# Altium schematic sheet busanalizer.SchDoc: powersupply_grid8.sch
size 409 x 282 mm; Date: 12/19/2018 10:57:12 PM; SheetNumber: Sheet:
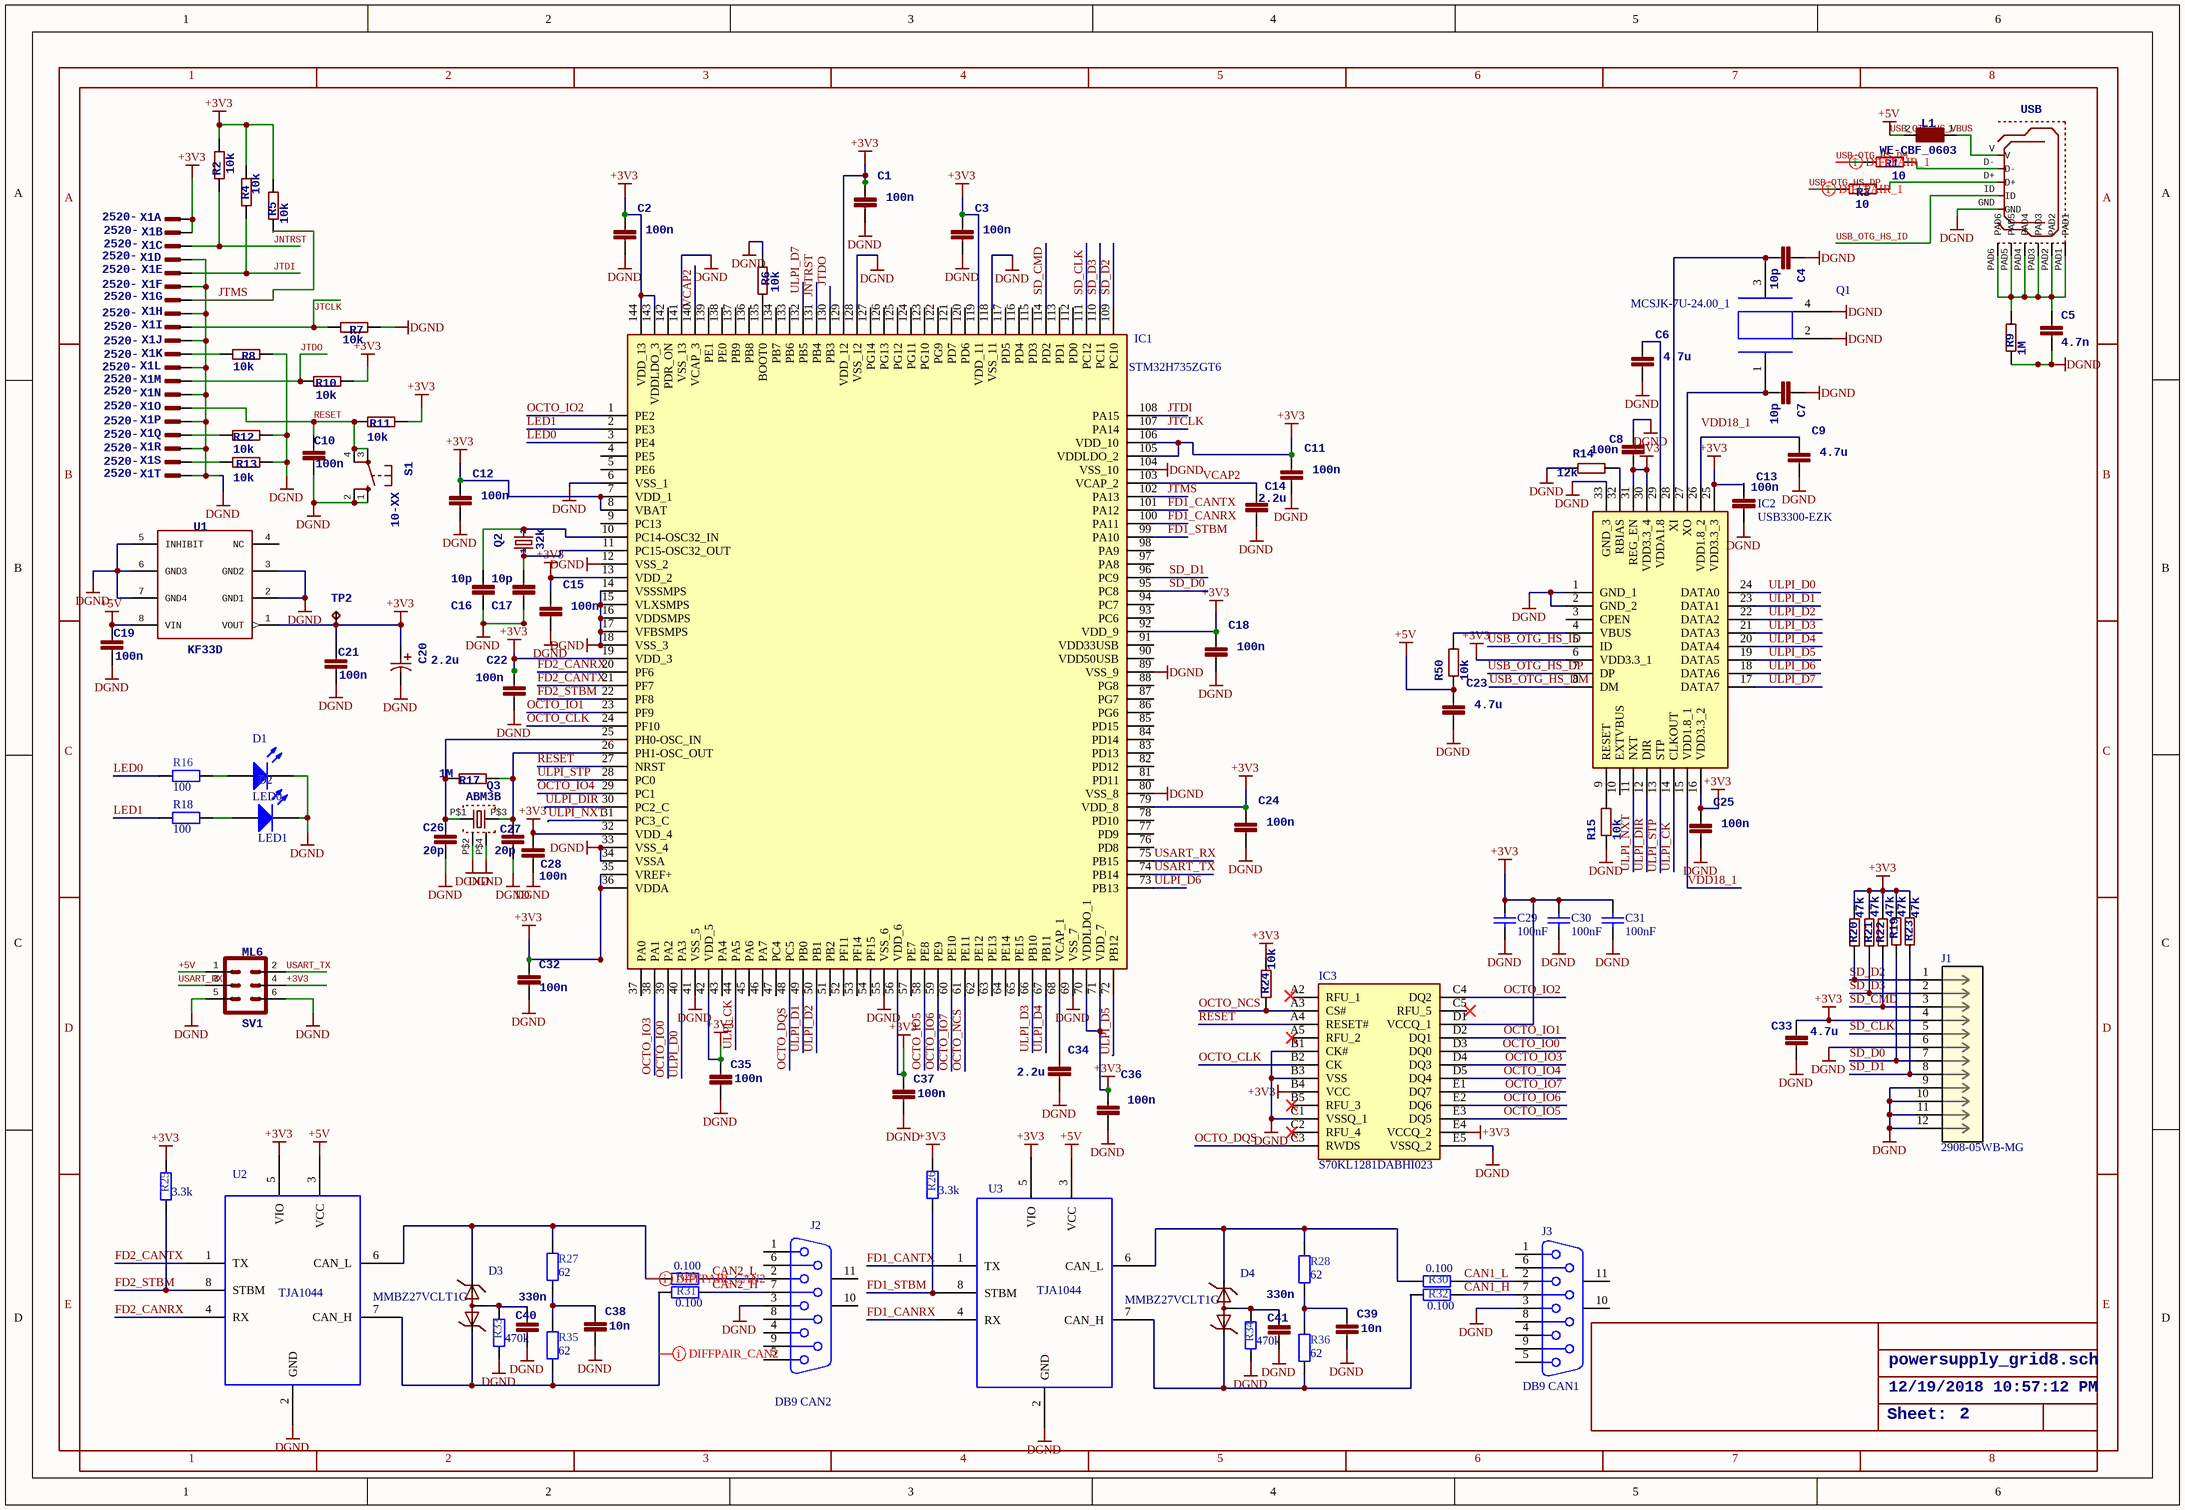
[diagram p0: busanalizer.SchDoc]

## Parts
C1  100n  [C0402]
C2  100n  [C0402]
C3  100n  [C0402]
C4  10p  [C0402]
C5  4.7n  [C0805]
C6  4.7u  [C0805]
C7  10p  [C0402]
C8  100n  [C0402]
C9  4.7u  [C0805]
C10  100n  [C0402]
C11  100n  [C0402]
C12  100n  [C0402]
C13  100n  [C0402]
C14  2.2u  [C0805]
C15  100n  [C0402]
C16  10p  [C0402]
C17  10p  [C0402]
C18  100n  [C0402]
C19  100n  [C0603]
C20  2.2u  [CAPAE430X610N]
C21  100n  [C0603]
C22  100n  [C0402]
C23  4.7u  [C0805]
C24  100n  [C0402]
C25  100n  [C0402]
C26  20p  [C0402]
C27  20p  [C0402]
C28  100n  [C0402]
C29  value 100nF  [C0402]  (hidden comment: Capacitor)
C30  value 100nF  [C0402]  (hidden comment: Capacitor)
C31  value 100nF  [C0402]  (hidden comment: Capacitor)
C32  100n  [C0402]
C33  4.7u  [C0805]
C34  2.2u  [C0805]
C35  100n  [C0402]
C36  100n  [C0402]
C37  100n  [C0402]
C38  10n  [C0805]
C39  10n  [C0805]
C40  330n  [C0805]
C41  330n  [C0805]
D1  LED0  [LED-0]
D2  LED1  [LED-0]
D3  MMBZ27VCLT1G  [SOT23]
D4  MMBZ27VCLT1G  [SOT23]
IC1  STM32H735ZGT6  [QFP50P2200X2200X160-144N]
IC2  USB3300-EZK  [QFN50P500X500X100-33N-D]
IC3  S70KL1281DABHI023  [BGA24C100P5X5_600X800X100]
J1  2908-05WB-MG  [CONN_3M_2900]
J2  DB9 CAN2  [DSUB1.385-2H9]
J3  DB9 CAN1  [DSUB1.385-2H9]
L1  WE-CBF_0603  [0603]
Q1  MCSJK-7U-24.00_1  [MCSJK-7U-24.00_1]
Q2  32k  [TC26V]
Q3  ABM3B  [ABM3B]
R1  10  [R0805]
R2  10k  [R0805]
R3  10  [R0805]
R4  10k  [R0805]
R5  10k  [R0805]
R6  10k  [R0805]
R7  10k  [R0805]
R8  10k  [R0805]
R9  1M  [R0805]
R10  10k  [R0805]
R11  10k  [R0805]
R12  10k  [R0805]
R13  10k  [R0805]
R14  12k  [R0805]
R15  10k  [R0805]
R16  value 100  [6-0805_L]  (hidden comment: Res2)
R17  1M  [R0402]
R18  value 100  [6-0805_L]  (hidden comment: Res2)
R19  47k  [R0805]
R20  47k  [R0805]
R21  47k  [R0805]
R22  47k  [R0805]
R23  47k  [R0805]
R24  10k  [R0805]
R25  value 3.3k  [R0805]  (hidden comment: Res2)
R26  value 3.3k  [R0805]  (hidden comment: Res2)
R27  value 62  [R0805]  (hidden comment: Res2)
R28  value 62  [R0805]  (hidden comment: Res2)
R29  value 0.100  [R0805]  (hidden comment: Res2)
R30  value 0.100  [R0805]  (hidden comment: Res2)
R31  value 0.100  [R0805]  (hidden comment: Res2)
R32  value 0.100  [R0805]  (hidden comment: Res2)
R33  value 470k  [R0805]  (hidden comment: Res2)
R34  value 470k  [R0805]  (hidden comment: Res2)
R35  value 62  [R0805]  (hidden comment: Res2)
R36  value 62  [R0805]  (hidden comment: Res2)
R50  10k  [R0805]
S1  10-XX  [B3F-10XX]
SV1  ML6  [ML6]
TP2  TPB2,54  [B2,54]  (value not drawn)
U1  KF33D  [SO8]
U2  TJA1044  [SO8]
U3  TJA1044  [SO8]
USB1  USB_MICROB  [USB_MICROB_PACKAGE]  (value not drawn)
X1  2520-  [PAK100/2500-20]  (parts A,B,C,D,E,F,G,H,I,J,K,L,M,N,O,P,Q,R,S,T of 20)

## Nets
+3V3: C1.1 C2.1 C3.1 C8.1 C11.1 C12.1 C13.1 C15.1 C18.1 C20.1 C21.1 C22.1 C24.1 C25.1 C28.1 C29.2 C30.2 C31.2 C32.1 C33.1 C35.1 C36.1 C37.1 IC1.7(VDD_1) IC1.8(VBAT) IC1.13(VDD_2) IC1.19(VDD_3) IC1.32(VDD_4) IC1.35(VREF+) IC1.36(VDDA) IC1.42(VDD_5) IC1.56(VDD_6) IC1.70(VDDLDO_1) IC1.71(VDD_7) IC1.79(VDD_8) IC1.92(VDD_9) IC1.105(VDDLDO_2) IC1.106(VDD_10) IC1.119(VDD_11) IC1.129(VDD_12) IC1.143(VDDLDO_3) IC1.144(VDD_13) IC2.6(VDD3.3_1) IC2.16(VDD3.3_2) IC2.25(VDD3.3_3) IC2.30(VDD3.3_4) IC2.31(REG_EN) IC3.B4(VCC) IC3.D1(VCCQ_1) IC3.E4(VCCQ_2) J1.4 R2.2 R4.2 R5.2 R10.1 R11.1 R19.2 R20.2 R21.2 R22.2 R23.2 R24.2 R25.2 R26.2 SV1.4 TP2.TP U1.1(VOUT) U2.5(VIO) U3.5(VIO) X1.1(KL) X1.2(KL)
+5V: C19.1 C23.1 L1.2 R50.1 SV1.1 U1.8(VIN) U2.3(VCC) U3.3(VCC)  [also labelled USB_OTG_HS_VBUS]
DGND: C1.2 C2.2 C3.2 C4.1 C5.2 C6.2 C7.1 C8.2 C9.2 C10.2 C11.2 C12.2 C13.2 C14.2 C15.2 C16.1 C17.1 C18.2 C19.2 C20.2 C21.2 C22.2 C23.2 C24.2 C25.2 C26.2 C27.2 C28.2 C29.1 C30.1 C31.1 C32.2 C33.2 C34.2 C35.2 C36.2 C37.2 C38.2 C39.2 C40.2 C41.2 D1.2(K) D2.2(K) IC1.6(VSS_1) IC1.12(VSS_2) IC1.14(VSSSMPS) IC1.15(VLXSMPS) IC1.16(VDDSMPS) IC1.17(VFBSMPS) IC1.18(VSS_3) IC1.33(VSS_4) IC1.34(VSSA) IC1.41(VSS_5) IC1.55(VSS_6) IC1.69(VSS_7) IC1.80(VSS_8) IC1.89(VSS_9) IC1.104(VSS_10) IC1.118(VSS_11) IC1.128(VSS_12) IC1.141(VSS_13) IC2.1(GND_1) IC2.2(GND_2) IC2.33(GND_3) IC3.B1(CK#) IC3.B3(VSS) IC3.C1(VSSQ_1) IC3.E5(VSSQ_2) J1.6 J1.9 J1.10 J1.11 J1.12 J2.3 J3.3 Q1.2 Q1.4 Q3.P$2 Q3.P$4 R6.1 R7.1 R8.1 R9.1 R12.1 R13.1 R14.1 R15.1 R33.1 R34.1 S1.1(S) S1.2(S1) SV1.5 SV1.6 U1.2(GND1) U1.3(GND2) U1.5(INHIBIT) U1.6(GND3) U1.7(GND4) U2.2(GND) U3.2(GND) USB1.GND X1.4(KL) X1.6(KL) X1.8(KL) X1.10(KL) X1.12(KL) X1.14(KL) X1.16(KL) X1.18(KL) X1.20(KL)
CAN1_H: J3.7 R32.2
CAN1_L: J3.2 R30.2
CAN2_H: J2.7 R31.2
CAN2_L: J2.2 R29.2
FD1_CANRX: IC1.100(PA11) U3.4(RX)
FD1_CANTX: IC1.101(PA12) U3.1(TX)
FD1_STBM: IC1.99(PA10) R26.1 U3.8(STBM)
FD2_CANRX: IC1.20(PF6) U2.4(RX)
FD2_CANTX: IC1.21(PF7) U2.1(TX)
FD2_STBM: IC1.22(PF8) R25.1 U2.8(STBM)
JNTRST: IC1.131(PB4) R2.1 X1.3(KL)
JTCLK: IC1.107(PA14) R7.2 X1.9(KL)
JTDI: IC1.108(PA15) R4.1 X1.5(KL)
JTDO: IC1.130(PB3) R10.2 X1.13(KL)
JTMS: IC1.102(PA13) R5.1 X1.7(KL)
LED0: IC1.3(PE4) R16.1
LED1: IC1.2(PE3) R18.1
OCTO_CLK: IC1.24(PF10) IC3.B2(CK)
OCTO_DQS: IC1.48(PC5) IC3.C3(RWDS)
OCTO_IO0: IC1.39(PA2) IC3.D3(DQ0)
OCTO_IO1: IC1.23(PF9) IC3.D2(DQ1)
OCTO_IO2: IC1.1(PE2) IC3.C4(DQ2)
OCTO_IO3: IC1.38(PA1) IC3.D4(DQ3)
OCTO_IO4: IC1.29(PC1) IC3.D5(DQ4)
OCTO_IO5: IC1.58(PE8) IC3.E3(DQ5)
OCTO_IO6: IC1.59(PE9) IC3.E2(DQ6)
OCTO_IO7: IC1.60(PE10) IC3.E1(DQ7)
OCTO_NCS: IC1.61(PE11) IC3.A3(CS#) R24.1
RESET: C10.1 IC1.27(NRST) IC3.A4(RESET#) R11.2 S1.3(P) S1.4(P1) X1.15(KL)
SD_CLK: IC1.111(PC12) J1.5
SD_CMD: IC1.114(PD2) J1.3 R22.1
SD_D0: IC1.95(PC8) J1.7 R19.1
SD_D1: IC1.96(PC9) J1.8 R23.1
SD_D2: IC1.109(PC10) J1.1 R20.1
SD_D3: IC1.110(PC11) J1.2 R21.1
ULPI_CK: IC1.44(PA5) IC2.14(CLKOUT)
ULPI_D0: IC1.40(PA3) IC2.24(DATA0)
ULPI_D1: IC1.49(PB0) IC2.23(DATA1)
ULPI_D2: IC1.50(PB1) IC2.22(DATA2)
ULPI_D3: IC1.66(PB10) IC2.21(DATA3)
ULPI_D4: IC1.67(PB11) IC2.20(DATA4)
ULPI_D5: IC1.72(PB12) IC2.19(DATA5)
ULPI_D6: IC1.73(PB13) IC2.18(DATA6)
ULPI_D7: IC1.132(PB5) IC2.17(DATA7)
ULPI_DIR: IC1.30(PC2_C) IC2.12(DIR)
ULPI_NXT: IC1.31(PC3_C) IC2.11(NXT)
ULPI_STP: IC1.28(PC0) IC2.13(STP)
USART_RX: IC1.75(PB15) SV1.3
USART_TX: IC1.74(PB14) SV1.2
USB_OTG_HS_DM: IC2.8(DM) R1.2
USB_OTG_HS_DP: IC2.7(DP) R3.2
USB_OTG_HS_ID: IC2.5(ID) USB1.ID
VCAP2: C14.1 IC1.103(VCAP_2) IC1.140(VCAP_3)
VDD18_1: IC2.15(VDD1.8_1)
NetC4_2: C4.2 IC2.28(XI) Q1.3
NetC5_1: C5.1 R9.2 USB1.PAD1 USB1.PAD2 USB1.PAD3 USB1.PAD4 USB1.PAD5 USB1.PAD6
NetC6_1: C6.1 IC2.29(VDDA1.8)
NetC7_2: C7.2 IC2.27(XO) Q1.1
NetC9_1: C9.1 IC2.26(VDD1.8_2)
NetC16_2: C16.2 IC1.10(PC14-OSC32_IN) Q2.2
NetC17_2: C17.2 IC1.11(PC15-OSC32_OUT) Q2.1
NetC26_1: C26.1 IC1.25(PH0-OSC_IN) Q3.P$1 R17.2
NetC27_1: C27.1 IC1.26(PH1-OSC_OUT) Q3.P$3 R17.1
NetC34_1: C34.1 IC1.68(VCAP_1)
NetC38_1: C38.1 R27.1 R35.2
NetC39_1: C39.1 R28.1 R36.2
NetC40_1: C40.1 D3.3(A) R33.2
NetC41_1: C41.1 D4.3(A) R34.2
NetD1_1: D1.1(A) R16.2
NetD2_1: D2.1(A) R18.2
NetD3_1: D3.1(K1) R27.2 R29.1 U2.6(CAN_L)
NetD3_2: D3.2(K2) R31.1 R35.1 U2.7(CAN_H)
NetD4_1: D4.1(K1) R28.2 R30.1 U3.6(CAN_L)
NetD4_2: D4.2(K2) R32.1 R36.1 U3.7(CAN_H)
NetIC1_135: IC1.135(BOOT0) R6.2
NetIC2_4: IC2.4(VBUS) R50.2
NetIC2_9: IC2.9(RESET) R15.2
NetIC2_32: IC2.32(RBIAS) R14.2
NetL1_1: L1.1 USB1.V
NetR1_1: R1.1 USB1.D-
NetR3_1: R3.1 USB1.D+
NetR8_2: R8.2 X1.11(KL)
NetR12_2: R12.2 X1.17(KL)
NetR13_2: R13.2 X1.19(KL)

Not connected (* = marked no-connect by the designer): IC1 4(PE5) 5(PE6) 9(PC13) 37(PA0) 43(PA4) 45(PA6) 46(PA7) 47(PC4) 51(PB2) 52(PF11) 53(PF14) 54(PF15) 57(PE7) 62(PE12) 63(PE13) 64(PE14) 65(PE15) 76(PD8) 77(PD9) 78(PD10) 81(PD11) 82(PD12) 83(PD13) 84(PD14) 85(PD15) 86(PG6) 87(PG7) 88(PG8) 90(VDD50USB) 91(VDD33USB) 93(PC6) 94(PC7) 97(PA8) 98(PA9) 112(PD0) 113(PD1) 115(PD3) 116(PD4) 117(PD5) 120(PD6) 121(PD7) 122(PG9) 123(PG10) 124(PG11) 125(PG12) 126(PG13) 127(PG14) 133(PB6) 134(PB7) 136(PB8) 137(PB9) 138(PE0) 139(PE1) 142(PDR_ON); IC2 3(CPEN) 10(EXTVBUS); IC3 A2(RFU_1) A5(RFU_2)* B5(RFU_3)* C2(RFU_4)* C5(RFU_5); J2 1 4 5 6 8 9 10(MH1) 11(MH2); J3 1 4 5 6 8 9 10(MH1) 11(MH2); U1 4(NC)

## Layout directives
differential pair: NetD3_1, NetD3_2, USB_OTG_HS_DM, USB_OTG_HS_DP

## Notes on the sheet
- Labels drawn without touching a wire or pin: VDD18_1
- 1
- 2
- 3
- 4
- 5
- 6
- 7
- 8
- A
- B
- C
- D
- E

## Library data of the parts
C1-C4 C6-C18 C22-C28 C32-C41 = C-EUC0402: <B>CAPACITOR</B>, European symbol; SPICEPREFIX: C
C5 = C-EUC0805: <B>CAPACITOR</B>, European symbol; SPICEPREFIX: C
C19 C21 = C-EUC0603: <B>CAPACITOR</B>, European symbol; SPICEPREFIX: C
C20 = EEE--CASE-B: MPN: EEE-FT0J101AR; MPN: EEE-FT1A680AR; MPN: EEE-FT1C470AR; MPN: EEE-FT1E220AR; MPN: EEE-FT1E330AR; MPN: EEE-FT1V220AR; MPN: EEE-FTH100UAR; MPN: EEE-HA0J220R; MPN: EEE-HA0J330WR; MPN: EEE-HA0J470WR; MPN: EEE-HA1A220WR; MPN: EEE-HA1A330WR; MPN: EEE-HA1C100R; MPN: EEE-HA1C220WR; MPN: EEE-HA1E100WR; MPN: EEE-HA1E4R7R; MPN: EEE-HA1H1R0R; MPN: EEE-HA1H2R2R; MPN: EEE-HA1H3R3R; MPN: EEE-HA1HR10R; MPN: EEE-HA1HR22R; MPN: EEE-HA1HR33R; MPN: EEE-HA1HR47R; MPN: EEE-HA1V100WR; MPN: EEE-HA1V4R7R; MPN: EEE-HB0J220R; MPN: EEE-HB1C100R; MPN: EEE-HB1E4R7R; MPN: EEE-HB1H1R0R; MPN: EEE-HB1H2R2R; MPN: EEE-HC0J220R; MPN: EEE-HC1C100R; MPN: EEE-HC1H1R0R; MPN: EEE-HC1H2R2R; MPN: EEE-HC1H3R3R; MPN: EEE-HC1HR10R; MPN: EEE-HC1HR33R; MPN: EEE-HC1HR47R; TOLERANCE: ±20 %; VOLTAGERATING: 6.3V; VOLTAGERATING: 10V; VOLTAGERATING: 16V; VOLTAGERATING: 25V; VOLTAGERATING: 35V; VOLTAGERATING: 50V; OC_FARNELL: 2065951; OC_NEWARK: 73T9146; PACKAGE: CASE-B; SUPPLIER: PANASONIC; OC_FARNELL: 2065959; OC_NEWARK: 73T9155; OC_FARNELL: 2065967; OC_NEWARK: 73T9160; OC_FARNELL: 1868402; OC_NEWARK: 31T8175; OC_FARNELL: 1868403; OC_NEWARK: 53W8320; OC_FARNELL: 1868413; OC_NEWARK: 31T8187; OC_FARNELL: 1868422; OC_NEWARK: 31T8171; OC_FARNELL: 1973274; OC_NEWARK: 58T9198; OC_FARNELL: 1973275; OC_NEWARK: 58T9199; OC_FARNELL: 1973276; OC_NEWARK: 58T9204; OC_FARNELL: 1973288; OC_NEWARK: 58T9209; OC_FARNELL: 1973291; OC_NEWARK: 58T9213; OC_FARNELL: 1973301; OC_NEWARK: 58T9217; OC_FARNELL: 1973302; OC_NEWARK: 58T9220; OC_FARNELL: 1973318; OC_NEWARK: 58T9233; OC_FARNELL: 1973317; OC_NEWARK: 58T9245; OC_FARNELL: 1973358; OC_NEWARK: 58T9253; OC_FARNELL: 1973359; OC_NEWARK: 58T9257; OC_FARNELL: 1973360; OC_NEWARK: 58T9260; OC_FARNELL: 1973353; OC_NEWARK: 58T9249; OC_FARNELL: 1973354; OC_NEWARK: 58T9250; OC_FARNELL: 1973355; OC_NEWARK: 58T9251; OC_FARNELL: 1973357; OC_NEWARK: unknown; OC_FARNELL: 1973338; OC_NEWARK: 58T9275; OC_FARNELL: 1973337; OC_NEWARK: 58T9286; OC_FARNELL: 9696750; OC_NEWARK: 96K9411; OC_FARNELL: 9696792; OC_NEWARK: 96K9414; OC_FARNELL: 9696822; OC_NEWARK: 96K9418; OC_FARNELL: 9696857; OC_NEWARK: 96K9419; OC_FARNELL: 9696865; OC_NEWARK: 96K9421; OC_FARNELL: 1714683; OC_NEWARK: 15R0902; OC_FARNELL: 1714692; OC_NEWARK: 15R0908; OC_FARNELL: 1714712; OC_NEWARK: 15R0921; OC_FARNELL: 1714713; OC_NEWARK: 15R0924; OC_FARNELL: 1714714; OC_NEWARK: 15R0926; OC_FARNELL: 1714708; OC_NEWARK: 15R0917; OC_FARNELL: 1714710; OC_NEWARK: 15R0919; OC_FARNELL: 1714711; OC_NEWARK: 15R0920
C29-C31 = MCD-00102: Capacitor, MLCC, 100nF, 16V, X7R, 10%, 0402, T=0,5mm; Manufacturer_Part_Number: CC0402KRX7R7BB104; Manufacturer: YAGEO; Alternate_Manufacturer_Part_Number: GCM155R71C104KA55D; Alternate_Manufacturer: MURATA; ECCN_US: EAR99; ECCN_EU: NEC; Provided_By: SUBCO; Internal_Part_Number: MCD-00102; Status: Released; Part_Type: Capacitor; Package: C0402; ComponentLink1Description: Datasheet; ComponentLink1URL: http://tunmcdsvn.tun.st.com/Component_Datasheet_Library/Trunk/Capacitors/Yageo_Multilayer_Capacitor_X7R_series_100pF_to_22uF
D1 D2 = LED0: Typical INFRARED GaAs LED; Published: 8-Jun-2000; LatestRevisionDate: 08-Jul-2005; LatestRevisionNote: Mech Layer 1 removed.; PackageReference: LED-0; Publisher: Altium Limited; PackageDescription: LED; 2 Leads
IC1 = STM32H735ZGT6: Integrated Circuit; Manufacturer_Name: STMicroelectronics; Datasheet Link: https://www.st.com/resource/en/datasheet/stm32h735zg.pdf; Height: 1.6mm; Manufacturer_Part_Number: STM32H735ZGT6
IC2 = USB3300-EZK: Integrated Circuit; Manufacturer_Name: Microchip; Datasheet Link: https://componentsearchengine.com//USB3300-EZK.pdf; Height: 1mm; Mouser2 Part Number: 886-USB3300-EZK; Mouser2 Price/Stock: https://www.mouser.com/Search/Refine.aspx?Keyword=886-USB3300-EZK; Manufacturer_Part_Number: USB3300-EZK
IC3 = S70KL1281DABHI023: Integrated Circuit; Manufacturer_Name: Cypress Semiconductor; Datasheet Link: https://www.cypress.com/file/183506/download; Height: 1mm; Manufacturer_Part_Number: S70KL1281DABHI023
J1 = 2908-05WB-MG: No Description Available; Vendor: 3M; Built_By: EMA_UL_Team; SourceLibrary: OnlineOrders_2014-07-19; Manufacturer_Part_Number: 2908-05WB-MG; Copyright: Copyright (C) 2018 Accelerated Designs. All rights reserved; RefDes: RefDes; Type: DEV
J2 J3 = D Connector 9: Receptacle Assembly, 9 Position, Right Angle; PackageDocument: O; Positions: 9; Published: 15-Jun-2001; LatestRevisionDate: 17-Jul-2002; LatestRevisionNote: Re-released for DXP Platform.; DatasheetDocument: 1-Sep-1999; PackageReference: 788750; Publisher: Altium Limited; Orientation: Right Angle; Gender: Receptacle
L1 = WE-CBF_0603: <b> SMD EMI Suppression Ferrite Beads WE-CBF</b> <p> / - Excellent anti-EMI properties <br> / - Low DC-restistance <br> / - Impedances till 3000 ohms <br> / - Rated current up to 6 A<p> / -- Reliable Ni-Sn electrodes<br> / -- Perfect as data lined filter and for uncoupling of distribution voltage<br>; MPN: 742792695; OC_FARNELL: 1635699; OC_NEWARK: 08P2449; PACKAGE: IND-0603; SUPPLIER: Wuerth Elektronik
Q2 = CRYSTALTC26V: <b>CRYSTAL</b>; OC_FARNELL: unknown; OC_NEWARK: unknown; 1: 1; 2: 2
R1-R13 R19-R24 = R-EU_R0805: <B>RESISTOR</B>, European symbol
R14 R15 R50 = R-EU_R0805: SPICEPREFIX: R
R16 R18 R25-R36 = Res2: Resistor; Published: 8-Jun-2000; LatestRevisionDate: 17-Jul-2002; LatestRevisionNote: Re-released for DXP Platform.; PackageReference: AXIAL-0.4; Publisher: Altium Limited; PackageDescription: Axial Device, Thru-Hole; 2 Leads; 0.4 in Pin Spacing
R17 = R-EU_R0402: <B>RESISTOR</B>, European symbol
S1 = 10-XX: <b>OMRON SWITCH</b>; MPN: B3F-1000; OC_FARNELL: 176432; OC_NEWARK: 36M3542
SV1 = ML6: <b>HARTING</b>; OC_FARNELL: unknown; OC_NEWARK: unknown
TP2 = TPB2,54: <b>Test pad</b>
USB1 = USB_MICROB: This is the hirose ZX62-B-5PA(11) MICRO-USB B Type female connection.; USB: USB
X1 = 2520-: <b>3M (TM) Pak 100 4-Wall Header</b><p> / Source: 3M; OC_FARNELL: unknown; OC_NEWARK: unknown